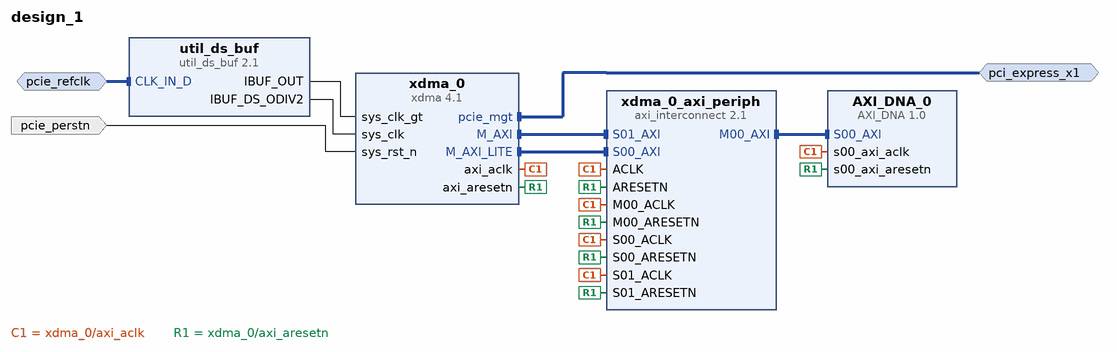
[diagram p0: block diagram of the top level]
# Vivado block design design_1, xcu200-fsgd2104-2-e, Vivado 2018.3
create_bd_design design_1

create_bd_intf_port -mode Master -vlnv xilinx.com:interface:pcie_7x_mgt_rtl:1.0 pci_express_x1
create_bd_intf_port -mode Slave -vlnv xilinx.com:interface:diff_clock_rtl:1.0 pcie_refclk
set_property -dict {CONFIG.FREQ_HZ 100000000} [get_bd_intf_ports pcie_refclk]
create_bd_port -dir I -type rst pcie_perstn
set_property -dict {CONFIG.POLARITY ACTIVE_LOW} [get_bd_ports pcie_perstn]

create_bd_cell -type ip -vlnv xilinx.com:ip:xdma:4.1 xdma_0
set_property -dict [list \
  CONFIG.PCIE_BOARD_INTERFACE pci_express_x1 \
  CONFIG.SYS_RST_N_BOARD_INTERFACE pcie_perstn \
  CONFIG.axilite_master_en true \
  CONFIG.xdma_axi_intf_mm AXI_Memory_Mapped \
] [get_bd_cells xdma_0]
create_bd_cell -type ip -vlnv xilinx.com:ip:util_ds_buf:2.1 util_ds_buf
set_property -dict {CONFIG.DIFF_CLK_IN_BOARD_INTERFACE pcie_refclk CONFIG.USE_BOARD_FLOW true} [get_bd_cells util_ds_buf]
create_bd_cell -type ip -vlnv xilinx.com:user:AXI_DNA:1.0 AXI_DNA_0
create_bd_cell -type ip -vlnv xilinx.com:ip:axi_interconnect:2.1 xdma_0_axi_periph
set_property -dict {CONFIG.NUM_MI 1 CONFIG.NUM_SI 2} [get_bd_cells xdma_0_axi_periph]

# ---- connections ----

connect_bd_intf_net [get_bd_intf_pins xdma_0/M_AXI] [get_bd_intf_pins xdma_0_axi_periph/S01_AXI]
connect_bd_intf_net [get_bd_intf_ports pci_express_x1] [get_bd_intf_pins xdma_0/pcie_mgt]
connect_bd_intf_net [get_bd_intf_ports pcie_refclk] [get_bd_intf_pins util_ds_buf/CLK_IN_D]
connect_bd_intf_net [get_bd_intf_pins xdma_0/M_AXI_LITE] [get_bd_intf_pins xdma_0_axi_periph/S00_AXI]
connect_bd_intf_net [get_bd_intf_pins xdma_0_axi_periph/M00_AXI] [get_bd_intf_pins AXI_DNA_0/S00_AXI]
connect_bd_net [get_bd_ports pcie_perstn] [get_bd_pins xdma_0/sys_rst_n]
connect_bd_net [get_bd_pins util_ds_buf/IBUF_OUT] [get_bd_pins xdma_0/sys_clk_gt]
connect_bd_net [get_bd_pins util_ds_buf/IBUF_DS_ODIV2] [get_bd_pins xdma_0/sys_clk]
connect_bd_net [get_bd_pins xdma_0/axi_aclk] \
  [get_bd_pins xdma_0_axi_periph/S00_ACLK] [get_bd_pins AXI_DNA_0/s00_axi_aclk] [get_bd_pins xdma_0_axi_periph/M00_ACLK] \
  [get_bd_pins xdma_0_axi_periph/ACLK] [get_bd_pins xdma_0_axi_periph/S01_ACLK]
connect_bd_net [get_bd_pins xdma_0/axi_aresetn] \
  [get_bd_pins xdma_0_axi_periph/S00_ARESETN] [get_bd_pins AXI_DNA_0/s00_axi_aresetn] \
  [get_bd_pins xdma_0_axi_periph/M00_ARESETN] [get_bd_pins xdma_0_axi_periph/ARESETN] \
  [get_bd_pins xdma_0_axi_periph/S01_ARESETN]

# ---- address map ----
assign_bd_address -offset 0x0000000044A00000 -range 64K -target_address_space [get_bd_addr_spaces xdma_0/M_AXI] [get_bd_addr_segs AXI_DNA_0/S00_AXI/S00_AXI_reg]
assign_bd_address -offset 0x44A00000 -range 64K -target_address_space [get_bd_addr_spaces xdma_0/M_AXI_LITE] [get_bd_addr_segs AXI_DNA_0/S00_AXI/S00_AXI_reg]

validate_bd_design
save_bd_design
